# Altium schematic sheet LED Board - SCH v1.0.0 20210410.SchDoc
size 190 x 203 mm; Date: 2021-04-10; DrawnBy: A. Gulyas; Revision: v1.0.0; SheetNumber: 1; SheetTotal: 1
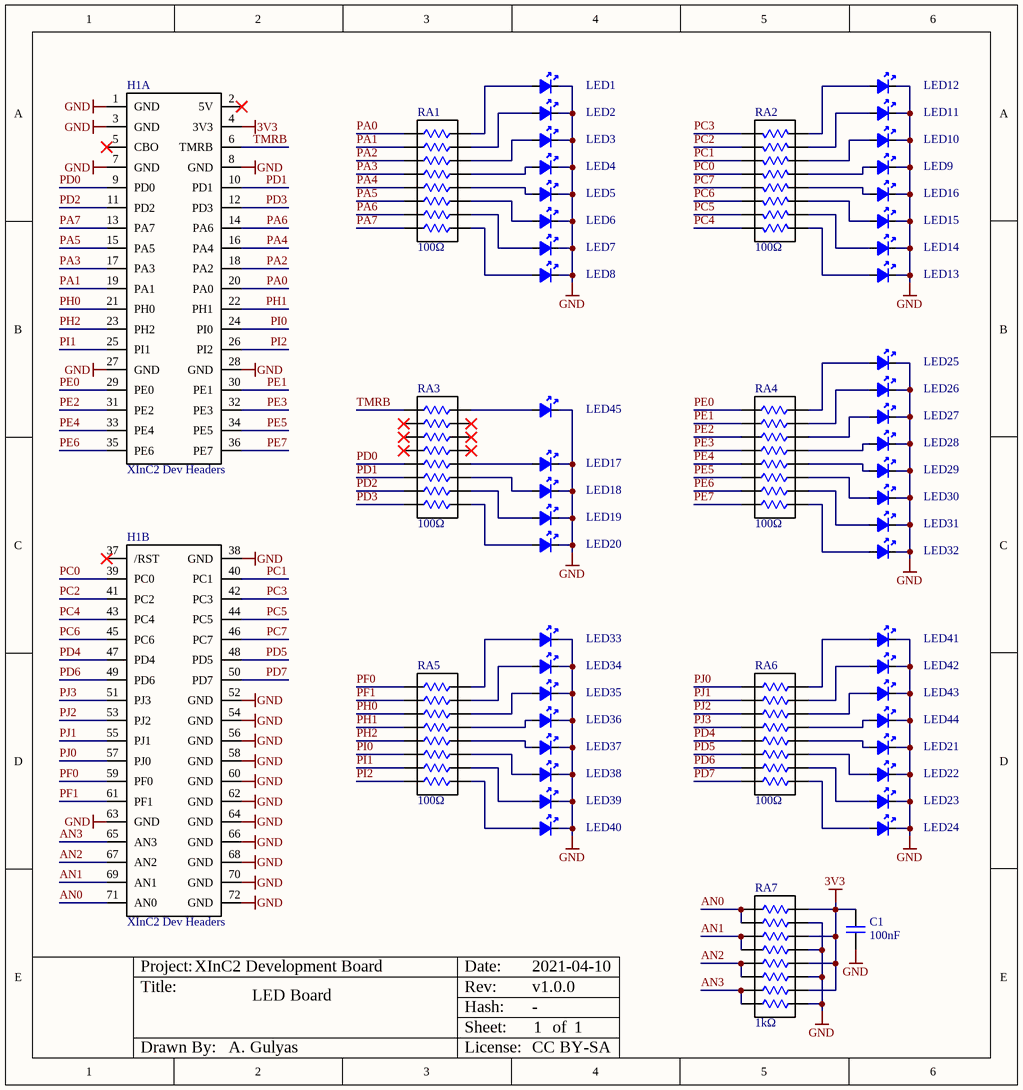
[diagram p0: LED Board - SCH v1.0.0 20210410.SchDoc]

## Parts
C1  100nF  [0603 - C]
H1  XInC2 Dev Headers  [XInC2 Dev Shield]  (parts A,B of 2)
LED1  Red  [LED - RED - TH]  (value not drawn)
LED2  Red  [LED - RED - TH]  (value not drawn)
LED3  Red  [LED - RED - TH]  (value not drawn)
LED4  Red  [LED - RED - TH]  (value not drawn)
LED5  Red  [LED - RED - TH]  (value not drawn)
LED6  Red  [LED - RED - TH]  (value not drawn)
LED7  Red  [LED - RED - TH]  (value not drawn)
LED8  Red  [LED - RED - TH]  (value not drawn)
LED9  Red  [LED - RED - TH]  (value not drawn)
LED10  Red  [LED - RED - TH]  (value not drawn)
LED11  Red  [LED - RED - TH]  (value not drawn)
LED12  Red  [LED - RED - TH]  (value not drawn)
LED13  Red  [LED - RED - TH]  (value not drawn)
LED14  Red  [LED - RED - TH]  (value not drawn)
LED15  Red  [LED - RED - TH]  (value not drawn)
LED16  Red  [LED - RED - TH]  (value not drawn)
LED17  Red  [LED - RED - TH]  (value not drawn)
LED18  Red  [LED - RED - TH]  (value not drawn)
LED19  Red  [LED - RED - TH]  (value not drawn)
LED20  Red  [LED - RED - TH]  (value not drawn)
LED21  Red  [LED - RED - TH]  (value not drawn)
LED22  Red  [LED - RED - TH]  (value not drawn)
LED23  Red  [LED - RED - TH]  (value not drawn)
LED24  Red  [LED - RED - TH]  (value not drawn)
LED25  Red  [LED - RED - TH]  (value not drawn)
LED26  Red  [LED - RED - TH]  (value not drawn)
LED27  Red  [LED - RED - TH]  (value not drawn)
LED28  Red  [LED - RED - TH]  (value not drawn)
LED29  Red  [LED - RED - TH]  (value not drawn)
LED30  Red  [LED - RED - TH]  (value not drawn)
LED31  Red  [LED - RED - TH]  (value not drawn)
LED32  Red  [LED - RED - TH]  (value not drawn)
LED33  Red  [LED - RED - TH]  (value not drawn)
LED34  Red  [LED - RED - TH]  (value not drawn)
LED35  Red  [LED - RED - TH]  (value not drawn)
LED36  Red  [LED - RED - TH]  (value not drawn)
LED37  Red  [LED - RED - TH]  (value not drawn)
LED38  Red  [LED - RED - TH]  (value not drawn)
LED39  Red  [LED - RED - TH]  (value not drawn)
LED40  Red  [LED - RED - TH]  (value not drawn)
LED41  Red  [LED - RED - TH]  (value not drawn)
LED42  Red  [LED - RED - TH]  (value not drawn)
LED43  Red  [LED - RED - TH]  (value not drawn)
LED44  Red  [LED - RED - TH]  (value not drawn)
LED45  Red  [LED - RED - TH]  (value not drawn)
RA1  100Ω  [0616 - 8 R array]
RA2  100Ω  [0616 - 8 R array]
RA3  100Ω  [0616 - 8 R array]
RA4  100Ω  [0616 - 8 R array]
RA5  100Ω  [0616 - 8 R array]
RA6  100Ω  [0616 - 8 R array]
RA7  1kΩ  [0616 - 8 R array]

## Nets
3V3: C1.1 H1.4(3V3) RA7.2 RA7.4 RA7.6 RA7.8
GND: C1.2 H1.1(GND) H1.3(GND) H1.7(GND) H1.8(GND) H1.27(GND) H1.28(GND) H1.38(GND) H1.52(GND) H1.54(GND) H1.56(GND) H1.58(GND) H1.60(GND) H1.62(GND) H1.63(GND) H1.64(GND) H1.66(GND) H1.68(GND) H1.70(GND) H1.72(GND) LED1.2 LED2.2 LED3.2 LED4.2 LED5.2 LED6.2 LED7.2 LED8.2 LED9.2 LED10.2 LED11.2 LED12.2 LED13.2 LED14.2 LED15.2 LED16.2 LED17.2 LED18.2 LED19.2 LED20.2 LED21.2 LED22.2 LED23.2 LED24.2 LED25.2 LED26.2 LED27.2 LED28.2 LED29.2 LED30.2 LED31.2 LED32.2 LED33.2 LED34.2 LED35.2 LED36.2 LED37.2 LED38.2 LED39.2 LED40.2 LED41.2 LED42.2 LED43.2 LED44.2 LED45.2 RA7.1 RA7.3 RA7.5 RA7.7
AN0: H1.71(AN0) RA7.9 RA7.10
AN1: H1.69(AN1) RA7.11 RA7.12
AN2: H1.67(AN2) RA7.13 RA7.14
AN3: H1.65(AN3) RA7.15 RA7.16
PA0: H1.20(PA0) RA1.1
PA1: H1.19(PA1) RA1.2
PA2: H1.18(PA2) RA1.3
PA3: H1.17(PA3) RA1.4
PA4: H1.16(PA4) RA1.5
PA5: H1.15(PA5) RA1.6
PA6: H1.14(PA6) RA1.7
PA7: H1.13(PA7) RA1.8
PC0: H1.39(PC0) RA2.13
PC1: H1.40(PC1) RA2.14
PC2: H1.41(PC2) RA2.15
PC3: H1.42(PC3) RA2.16
PC4: H1.43(PC4) RA2.9
PC5: H1.44(PC5) RA2.10
PC6: H1.45(PC6) RA2.11
PC7: H1.46(PC7) RA2.12
PD0: H1.9(PD0) RA3.5
PD1: H1.10(PD1) RA3.6
PD2: H1.11(PD2) RA3.7
PD3: H1.12(PD3) RA3.8
PD4: H1.47(PD4) RA6.13
PD5: H1.48(PD5) RA6.14
PD6: H1.49(PD6) RA6.15
PD7: H1.50(PD7) RA6.16
PE0: H1.29(PE0) RA4.1
PE1: H1.30(PE1) RA4.2
PE2: H1.31(PE2) RA4.3
PE3: H1.32(PE3) RA4.4
PE4: H1.33(PE4) RA4.5
PE5: H1.34(PE5) RA4.6
PE6: H1.35(PE6) RA4.7
PE7: H1.36(PE7) RA4.8
PF0: H1.59(PF0) RA5.1
PF1: H1.61(PF1) RA5.2
PH0: H1.21(PH0) RA5.3
PH1: H1.22(PH1) RA5.4
PH2: H1.23(PH2) RA5.5
PI0: H1.24(PI0) RA5.6
PI1: H1.25(PI1) RA5.7
PI2: H1.26(PI2) RA5.8
PJ0: H1.57(PJ0) RA6.9
PJ1: H1.55(PJ1) RA6.10
PJ2: H1.53(PJ2) RA6.11
PJ3: H1.51(PJ3) RA6.12
TMRB: H1.6(TMRB) RA3.1
NetLED1_1: LED1.1 RA1.16
NetLED2_1: LED2.1 RA1.15
NetLED3_1: LED3.1 RA1.14
NetLED4_1: LED4.1 RA1.13
NetLED5_1: LED5.1 RA1.12
NetLED6_1: LED6.1 RA1.11
NetLED7_1: LED7.1 RA1.10
NetLED8_1: LED8.1 RA1.9
NetLED9_1: LED9.1 RA2.4
NetLED10_1: LED10.1 RA2.3
NetLED11_1: LED11.1 RA2.2
NetLED12_1: LED12.1 RA2.1
NetLED13_1: LED13.1 RA2.8
NetLED14_1: LED14.1 RA2.7
NetLED15_1: LED15.1 RA2.6
NetLED16_1: LED16.1 RA2.5
NetLED17_1: LED17.1 RA3.12
NetLED18_1: LED18.1 RA3.11
NetLED19_1: LED19.1 RA3.10
NetLED20_1: LED20.1 RA3.9
NetLED21_1: LED21.1 RA6.4
NetLED22_1: LED22.1 RA6.3
NetLED23_1: LED23.1 RA6.2
NetLED24_1: LED24.1 RA6.1
NetLED25_1: LED25.1 RA4.16
NetLED26_1: LED26.1 RA4.15
NetLED27_1: LED27.1 RA4.14
NetLED28_1: LED28.1 RA4.13
NetLED29_1: LED29.1 RA4.12
NetLED30_1: LED30.1 RA4.11
NetLED31_1: LED31.1 RA4.10
NetLED32_1: LED32.1 RA4.9
NetLED33_1: LED33.1 RA5.16
NetLED34_1: LED34.1 RA5.15
NetLED35_1: LED35.1 RA5.14
NetLED36_1: LED36.1 RA5.13
NetLED37_1: LED37.1 RA5.12
NetLED38_1: LED38.1 RA5.11
NetLED39_1: LED39.1 RA5.10
NetLED40_1: LED40.1 RA5.9
NetLED41_1: LED41.1 RA6.8
NetLED42_1: LED42.1 RA6.7
NetLED43_1: LED43.1 RA6.6
NetLED44_1: LED44.1 RA6.5
NetLED45_1: LED45.1 RA3.16

Not connected (* = marked no-connect by the designer): H1 2(5V)* 5(CBO)* 37(/RST)*; RA3 2* 3* 4* 13* 14* 15*

## Notes on the sheet
- Project:
- XInC2 Development Board
- Date:
- Title:
- LED Board
- Rev:
- Hash:
- Sheet:
- -
- of
- Drawn By:
- License:
- CC BY-SA

## Library data of the parts
C1 = C - 0603 - 100nF - 16V: CAP CER 0.1UF 16V X7R 0603; MFG: Yageo; MFG PN: CC0603KRX7R7BB104; Value: 0.1µF; Tolerance: ±10%; Op Temp: -55°C ~ 125°C; Digi-Key PN: 311-1088-1-ND; Package: 0603; Temp Coeff: X7R; Series: CC; Price/1 @10: $0.064; Height: 0.9 mm; Composition: Ceramic; Voltage - Rated: 16V; Mounting Type: Surface Mount, MLCC
H1 = XInC2 Dev 2 Shield: Two 2x16 female headers than mate with a XInC2 Dev Board
LED1-LED45 = LED - TH - Red: LED RED DIFFUSED 5MM ROUND T/H; MFG: Würth Elektronik; MFG PN: 151051RS11000; Millicandela Rating: 30mcd; Lens Style: Round with Domed Top; Lens Size: 4.90mm Dia; Voltage - Forward (Vf) (Typ): 2.1V; Current - Test: 20mA; Viewing Angle: 60°; Wavelength - Dominant: 645nm; Wavelength - Peak: 650nm; Digi-Key PN: 732-5016-ND; Height: 8.95mm; Mounting Type: Through Hole; Package: Radial; Color: Red; Lens Color: Red; Lens Transparency: Diffused; Price/1 @10: $0.22; ComponentLink1Description: Datasheet; ComponentLink1URL: E:\!Projects\50. XInC2 Dev 2\git\Datasheets\Wurth - 151051RS11000 - TH LED.pdf; ComponentLink2Description: Online Datasheet; ComponentLink2URL: https://www.we-online.de/katalog/datasheet/151051RS11000.pdf; Series: WL-TMRC; Purpose: *
RA1-RA6 = RA - 100Ω - 8: RES ARRAY 8 RES 100 OHM 1606; Circuit Type: Isolated; Tolerance: ±5%; Number of Resistors: 8; Power Per Element: 62.5mW; Temp Coeff: ±200ppm/°C; Op Temp: -55°C ~ 155°C; Digi-Key PN: YC248J-100CT-ND; Series: YC248; Value: 100Ω; Mounting Type: Surface Mount; Package: 1606, Convex, Long Side Terminals; Height: 0.55mm; Number of Pins: 16; ComponentLink1Description: Datasheet; ComponentLink1URL: E:\!Projects\50. XInC2 Dev 2\git\Datasheets\Yageo - YC TC Series.pdf; ComponentLink2Description: Online Datasheet; ComponentLink2URL: https://www.yageo.com/upload/media/product/productsearch/datasheet/rchip/PYu-YC_TC_group_51_RoHS_L_9.pdf
RA7 = RA - 1kΩ - 8: RES ARRAY 8 RES 1K OHM 1606; Circuit Type: Isolated; Tolerance: ±5%; Number of Resistors: 8; Power Per Element: 62.5mW; Temp Coeff: ±200ppm/°C; Op Temp: -55°C ~ 155°C; Digi-Key PN: YC248J-1.0KCT-ND; Series: YC248; Value: 1kΩ; Mounting Type: Surface Mount; Package: 1606, Convex, Long Side Terminals; Height: 0.55mm; Number of Pins: 16; ComponentLink1Description: Datasheet; ComponentLink1URL: E:\!Projects\50. XInC2 Dev 2\git\Datasheets\Yageo - YC TC Series.pdf; ComponentLink2Description: Online Datasheet; ComponentLink2URL: https://www.yageo.com/upload/media/product/productsearch/datasheet/rchip/PYu-YC_TC_group_51_RoHS_L_9.pdf